# Altium project MachRada.PrjPcb
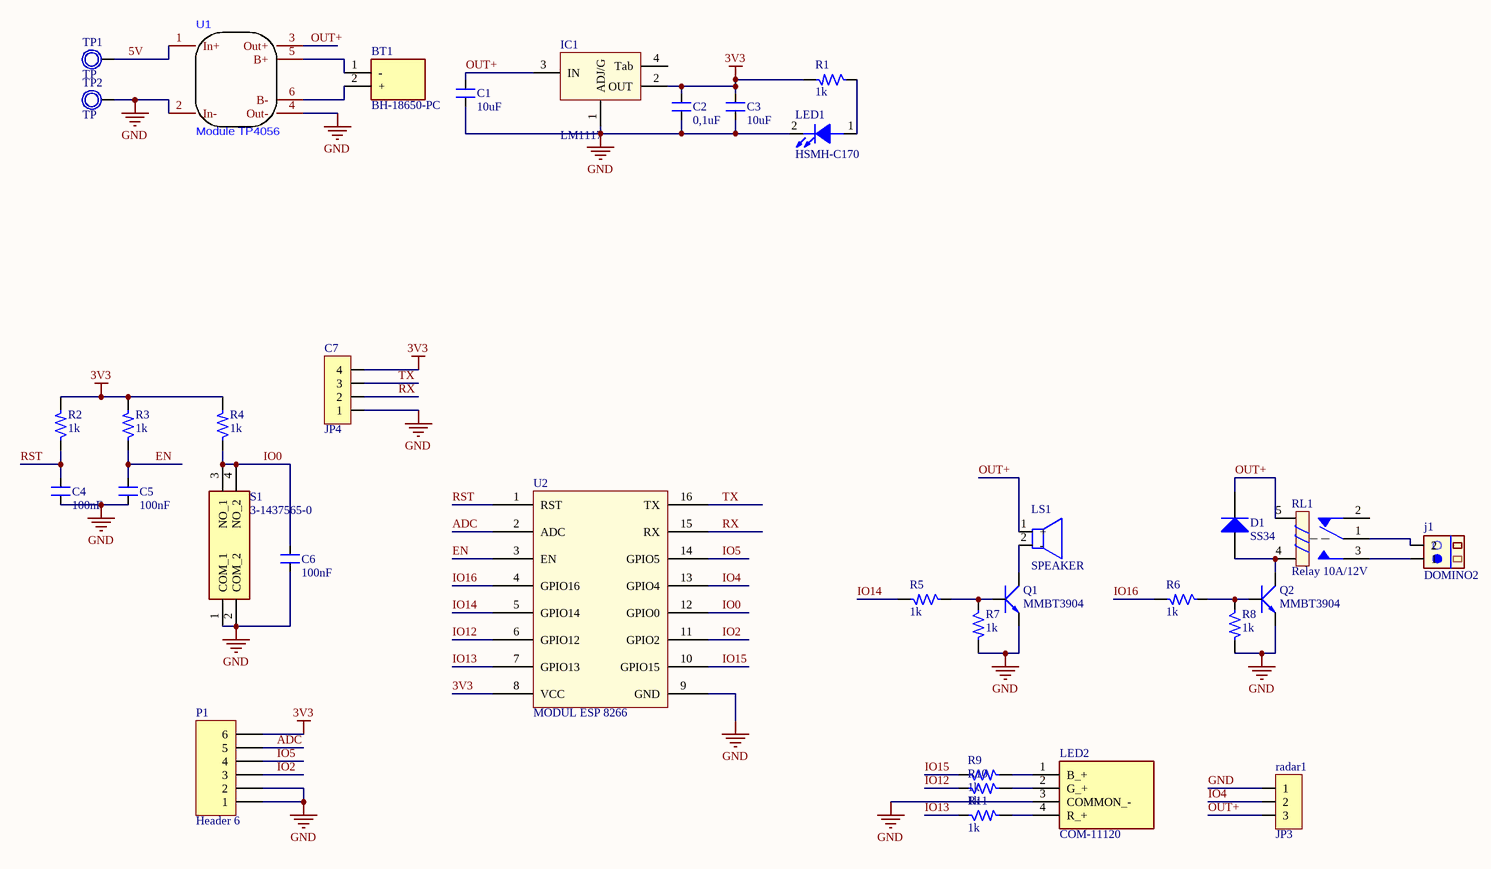
[diagram p0: MachRada.SchDoc]
1 sheet, 35 parts. Net scope: global (net labels, ports and power ports of the same name join across sheets).
Board file: MachRada.PcbDoc

## Sheet MachRada.SchDoc
size 381 x 241 mm; SheetNumber: 1; SheetTotal: 1

### Parts
BT1  BH-18650-PC  [PIN 18650PC]
C1  10uF  [C1206]
C2  0,1uF  [SM-CAP-0805]
C3  10uF  [C1206]
C4  100nF  [SM-CAP-0805]
C5  100nF  [SM-CAP-0805]
C6  100nF  [SM-CAP-0805]
C7  JP4  [JP4-C1T]
D1  SS34  [DIOT]
IC1  LM1117  [LM1117-3V3-5V]
j1  DOMINO2  [DOMINO2]
LED1  HSMH-C170  [LED]
LED2  COM-11120  [LED RGB 10MM]
LS1  SPEAKER  [speaker]
P1  Header 6  [Header 6]
Q1  MMBT3904  [MMBT 3904]
Q2  MMBT3904  [MMBT 3904]
R1  1k  [SM-RES-0805]
R2  1k  [SM-RES-0805]
R3  1k  [SM-RES-0805]
R4  1k  [SM-RES-0805]
R5  1k  [SM-RES-0805]
R6  1k  [SM-RES-0805]
R7  1k  [SM-RES-0805]
R8  1k  [SM-RES-0805]
R9  1k  [SM-RES-0805]
R10  1k  [SM-RES-0805]
R11  1k  [SM-RES-0805]
radar1  JP3  [JP3-C1T]
RL1  Relay 10A/12V  [RELAY 5]
S1  3-1437565-0  [Button SMD]
TP1  TP  [TP1]
TP2  TP  [TP1]
U1  Module TP4056  [Module TP4056]
U2  MODUL ESP 8266  [esp8622 v7]

### Nets
3V3: C2.2 C3.2 C7.4 IC1.2(OUT) P1.6 R1.2 R2.2 R3.2 R4.2 U2.8(VCC)
GND: C1.1 C2.1 C3.1 C4.2 C5.2 C6.2 C7.1 IC1.1(ADJ/G) LED1.2(K) LED2.3(COMMON_-) P1.1 P1.2 Q1.2(E) Q2.2(E) R7.2 R8.2 radar1.1 S1.1(COM_1) S1.2(COM_2) TP2.1 U1.2(In-) U1.4(Out-) U2.9(GND)
5V: TP1.1 U1.1(In+)
ADC: P1.5 U2.2(ADC)
EN: C5.1 R3.1 U2.3(EN)
IO0: C6.1 R4.1 S1.3(NO_1) S1.4(NO_2) U2.12(GPIO0)
IO2: P1.3 U2.11(GPIO2)
IO4: radar1.2 U2.13(GPIO4)
IO5: P1.4 U2.14(GPIO5)
IO12: R10.1 U2.6(GPIO12)
IO13: R11.1 U2.7(GPIO13)
IO14: R5.2 U2.5(GPIO14)
IO15: R9.1 U2.10(GPIO15)
IO16: R6.2 U2.4(GPIO16)
OUT+: C1.2 D1.2(K) IC1.3(IN) LS1.1(+) radar1.3 RL1.5 U1.3(Out+)
RST: C4.1 R2.1 U2.1(RST)
RX: C7.2 U2.15(RX)
TX: C7.3 U2.16(TX)
NetBT1_1: BT1.1(-) U1.5(B+)
NetBT1_2: BT1.2(+) U1.6(B-)
NetD1_1: D1.1(A) Q2.3(C) RL1.4
Netj1_1: j1.1 RL1.3
Netj1_2: j1.2 RL1.1
NetLED1_1: LED1.1(A) R1.1
NetLED2_1: LED2.1(B_+) R9.2
NetLED2_2: LED2.2(G_+) R10.2
NetLED2_4: LED2.4(R_+) R11.2
NetLS1_2: LS1.2(-) Q1.3(C)
NetQ1_1: Q1.1(B) R5.1 R7.1
NetQ2_1: Q2.1(B) R6.1 R8.1

Not connected (* = marked no-connect by the designer): IC1 4(Tab); RL1 2

### Library data of the parts
BT1 = PIN 18650-PC: Battery; Manufacturer_Name: MPD (Memory Protection Devices); Datasheet Link: http://www.memoryprotectiondevices.com/datasheets/BH-18650-PC-datasheet.pdf; Height: 21.31mm; Manufacturer_Part_Number: BH-18650-PC
C1 = CN: 10uF/25V; Value: 0,1uF/300V; Designed by: VanDungEvn
C2-C6 = CN: 0,1uF/300V; Designed by: VanDungEvn; Value: 0,1uF/300V
C7 = JP4: WR-PHD 2.54 mm Angled Socket Header; Manufacturer: W¨¹rth Elektronik eiSos GmbH; partNo: 613004143121; ComponentLink1 Description: Manufacturer; ComponentLink2 Description: Datasheet; NoPins: 04; Created Date: 29 March 2013; ComponentLink1URL: http://www.we-online.com; ComponentLink2URL: http://katalog.we-online.de/em/datasheet/6130xx143121.pdf; Created by: Karrer Zheng
D1 = Diode 1N4007: 1 Amp General Purpose Rectifier; Published: 8-Jun-2000; LatestRevisionDate: 17-Jul-2002; LatestRevisionNote: Re-released for DXP Platform.; DatasheetVersion: 1998; PackageVersion: Aug-1999; PackageReference: DO-41; Publisher: Altium Limited; PackageDescription: Diode, Axial; Body 5.2 x 2.7 mm (LxDia. max), Lead Dia. 0.86 mm (max); Code_JEDEC: DO-204-AL; ComponentLink1Description: Manufacturer Link; ComponentLink1URL: http://www.fairchildsemi.com/; ComponentLink2Description: Datasheet; ComponentLink2URL: http://www.fairchildsemi.com/ds/1N%2F1N4001.pdf
IC1 = LM1117: 3v3; Value: LM317
LED1 = LED_1: Typical GaAs SMD LED; Manufacturer: Lite-On Inc; Color: RED; Type: Cong ty RP; Vendor: Digikey; Publisher: Hoang Nguyen; Price: *; Published: 13-April-2009; ComponentLink1Description: Digikey Part Link; ComponentLink2Description: Open Datasheet; ComponentLink2URL: H:\LIBRARY\LIBRARY.Datasheet\
LED2 = LED RGB 10MM: LED; Manufacturer_Name: SparkFun; Datasheet Link: http://cdn.sparkfun.com/datasheets/Components/General/YSL-R1047CR4G3BW-F8.pdf; Height: 13mm; Manufacturer_Part_Number: COM-11120; Mouser Part Number: 474-COM-11120; Mouser Price/Stock: https://www.mouser.co.uk/ProductDetail/SparkFun/COM-11120?qs=WyAARYrbSnauAm%2FsFIz3Fw%3D%3D; Arrow Part Number: COM-11120; Arrow Price/Stock: https://www.arrow.com/en/products/com-11120/sparkfun-electronics
LS1 = SPEAKER: Vendor: Digikey; Published: 13-April-2009; Publisher: Hoang Nguyen; ComponentLink1Description: Digikey Part Link; ComponentLink2Description: Open Datasheet; ComponentLink2URL: H:\LIBRARY\LIBRARY.Datasheet\
P1 = Header 6: Header, 6-Pin; LatestRevisionDate: 17-Jul-2002; LatestRevisionNote: Re-released for DXP Platform.; Publisher: Altium Limited
R1-R11 = R_1: Resistor 1/4W; Value: R1/4W - 1K
radar1 = JP3: WR-PHD 2.54 mm Angled Socket Header; Manufacturer: W¨¹rth Elektronik eiSos GmbH; partNo: 613003143121; ComponentLink1 Description: Manufacturer; ComponentLink2 Description: Datasheet; NoPins: 03; Created Date: 29 March 2013; ComponentLink1URL: http://www.we-online.com; ComponentLink2URL: http://katalog.we-online.de/em/datasheet/6130xx143121.pdf; Created by: Karrer Zheng
RL1 = Relay 5: Relay SPDT,10A - 5VDC 5 Pin; Value: Relay SPDT, 10A, 12V
S1 = Button: Switch; Manufacturer_Name: TE Connectivity; Datasheet Link: https://www.te.com/commerce/DocumentDelivery/DDEController?Action=showdoc&DocId=Customer+Drawing%7F2-1437565-7%7FV%7Fpdf%7FEnglish%7FENG_CD_2-1437565-7_V.pdf%7F3-1437565-0; Height: 4.39mm; Manufacturer_Part_Number: 3-1437565-0; Mouser Part Number: 506-3-1437565-0; Mouser Price/Stock: https://www.mouser.co.uk/ProductDetail/TE-Connectivity-PB/3-1437565-0?qs=%2FwXgF%2FfIho%2FDAgSy8ONeew%3D%3D; Arrow Part Number: 3-1437565-0; Arrow Price/Stock: https://www.arrow.com/en/products/3-1437565-0/te-connectivity
TP1 TP2 = TP1: Test Point; Value: Test Point
U2 = MODUL ESP 8622